# Altium schematic sheet MR_Power.SchDoc
size A4; CompanyName: BeeIonic; SheetNumber: 5; SheetTotal: 7
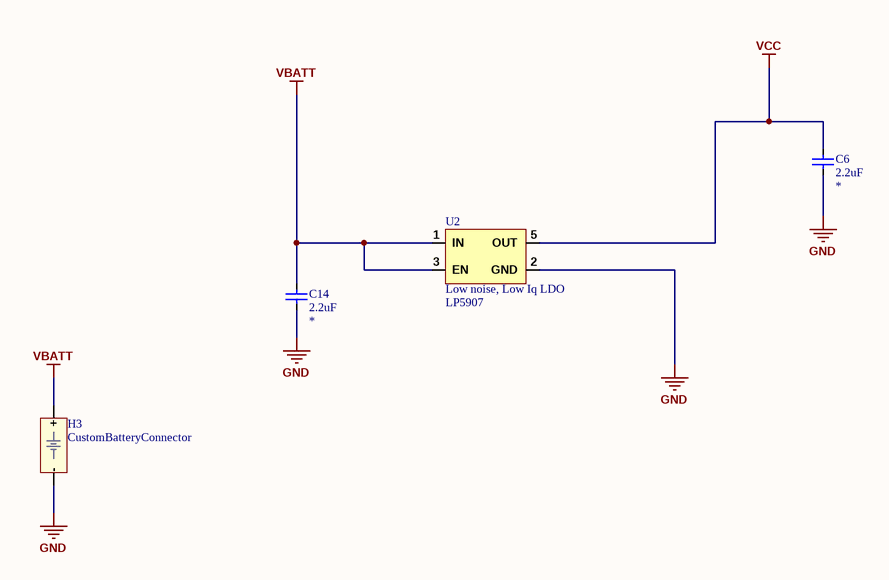
[diagram p0: MR_Power.SchDoc]

## Parts
C6  value 2.2uF  [0603_CAP_LD]  (hidden comment: CerCap)
C14  value 2.2uF  [0603_CAP_LD]  (hidden comment: CerCap)
H3  CustomBatteryConnector  [CustomBatteryConnector]
U2  Low noise, Low Iq LDO  [LP5907]

## Nets
GND: C6.1 C14.1 H3.- U2.2(GND)
VBATT: C14.2 H3.+ U2.1(IN) U2.3(EN)
VCC: C6.2 U2.5(OUT)

Not connected (* = marked no-connect by the designer): U2 4(NC)

## Notes on the sheet
- Project :
- Title :
- Sheet:
- of
- Creation Date :
- Designer :
- Modified Date :

## Library data of the parts
C6 C14 = CerCap: Ceramic Capacitor; Type: *; Voltage/Power: *; Package: *
H3 = BatteryConnector: Custom Battery Connector
U2 = LP5907: LP5907 Low Noise Low Iq LDO; Reference: LP5907